# Altium schematic sheet TopSchematic.SchDoc: Title
size A4; SchTemplateVer: V2.0; Author: Adam Mizerkiewicz; CompanyName: Adam Mizerkiewicz; DrawnBy: Adam Mizerkiewicz; Engineer: Adam Mizerkiewicz; Organization: Adam Mizerkiewicz; Address1: Sarnia 2/19; Address2: 61-058 Poznań; Revision: 0.0; SheetNumber: 2; SheetTotal: 18
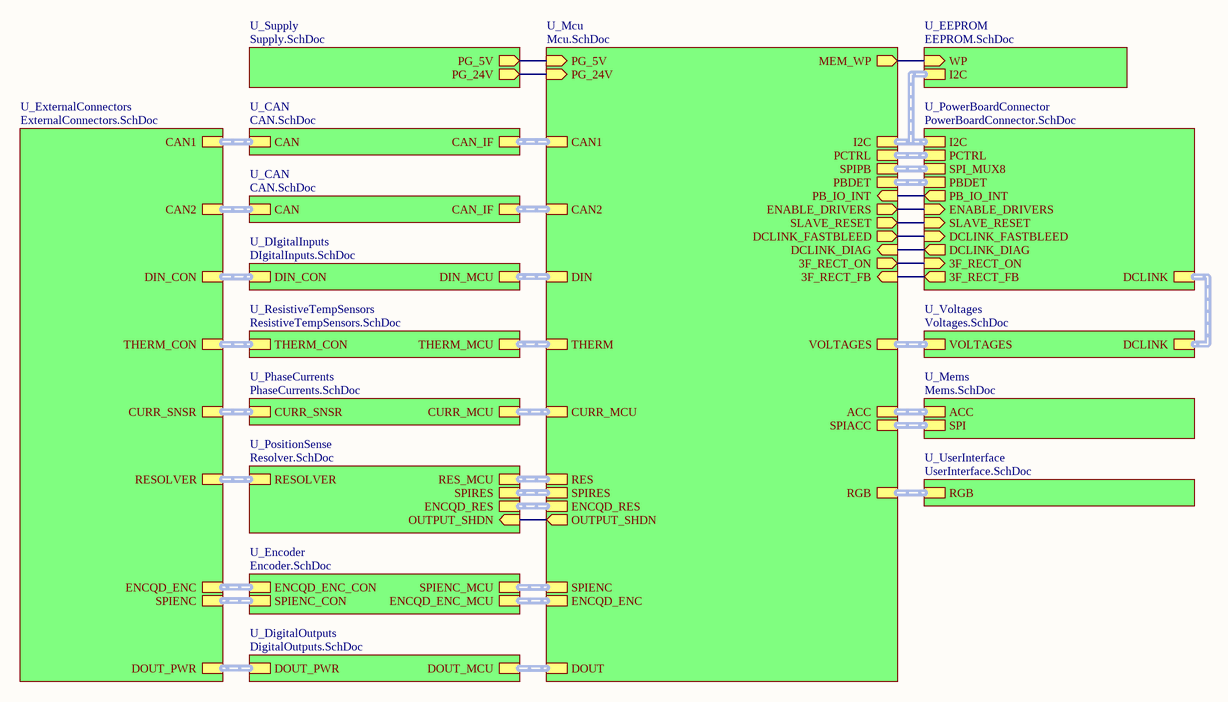
[diagram p0: TopSchematic.SchDoc]

## Sub-sheets
U_CAN = CAN.SchDoc: CAN_IF (harness CAN_IF), CAN (harness CAN)
U_CAN = CAN.SchDoc: CAN_IF (harness CAN_IF), CAN (harness CAN)
U_DIgitalInputs = DIgitalInputs.SchDoc: DIN_CON (harness DIN_CON), DIN_MCU (harness DIN_MCU)
U_DigitalOutputs = DigitalOutputs.SchDoc: DOUT_MCU (harness DOUT_MCU), DOUT_PWR (harness DOUT_PWR)
U_EEPROM = EEPROM.SchDoc: I2C (harness I2C), WP (in)
U_Encoder = Encoder.SchDoc: SPIENC_MCU (harness SPI), ENCQD_ENC_MCU (harness ENCQD), SPIENC_CON (harness SPI), ENCQD_ENC_CON (harness ENCQD)
U_ExternalConnectors = ExternalConnectors.SchDoc: CAN2 (harness CAN), DOUT_PWR (harness DOUT_PWR), DIN_CON (harness DIN_CON), THERM_CON (harness THERM_CON), RESOLVER (harness RESOLVER), SPIENC (harness SPI), CURR_SNSR (harness CURR_SNSR), CAN1 (harness CAN), ENCQD_ENC (harness ENCQD)
U_Mcu = Mcu.SchDoc: CAN1 (harness CAN_IF), CAN2 (harness CAN_IF), PCTRL (harness PCTRL), SPIPB (harness SPI_MUX8), SPIACC (harness SPI), SPIRES (harness SPI), ACC (harness ACC/GYRO), DIN (harness DIN_MCU), I2C (harness I2C), THERM (harness THERM_MCU), PBDET (harness PBDET), DOUT (harness DOUT_MCU), ENCQD_RES (harness ENCQD), SPIENC (harness SPI), RES (harness RESOLVER_IF), DCLINK_FASTBLEED (out), DCLINK_DIAG (in), PB_IO_INT (in), ENABLE_DRIVERS (out), SLAVE_RESET (out), 3F_RECT_ON (out), 3F_RECT_FB (in), VOLTAGES (harness VOLTAGES_MCU), RGB (harness RGB), ENCQD_ENC (harness ENCQD), CURR_MCU (harness CURR_MCU), OUTPUT_SHDN (out), PG_5V (in), PG_24V (in), MEM_WP (out)
U_Mems = Mems.SchDoc: ACC (harness ACC/GYRO_IF), SPI (harness SPI)
U_PhaseCurrents = PhaseCurrents.SchDoc: CURR_SNSR (harness CURR_SNSR), CURR_MCU (harness CURR_MCU)
U_PositionSense = Resolver.SchDoc: RES_MCU (harness RESOLVER_IF), SPIRES (harness SPI), ENCQD_RES (harness ENCQD), RESOLVER (harness RESOLVER), OUTPUT_SHDN (in)
U_PowerBoardConnector = PowerBoardConnector.SchDoc: SPI_MUX8 (harness SPI_MUX8), PCTRL (harness PCTRL), DCLINK_FASTBLEED (in), DCLINK_DIAG (out), PB_IO_INT (out), DCLINK (harness DC_LINK), ENABLE_DRIVERS (in), SLAVE_RESET (in), 3F_RECT_ON (in), 3F_RECT_FB (out), I2C (harness I2C), PBDET (harness PBDET)
U_ResistiveTempSensors = ResistiveTempSensors.SchDoc: THERM_MCU (harness THERM_MCU), THERM_CON (harness THERM_CON)
U_Supply = Supply.SchDoc: PG_5V (out), PG_24V (out)
U_UserInterface = UserInterface.SchDoc: RGB (harness RGB)
U_Voltages = Voltages.SchDoc: DCLINK (harness DCLINK), VOLTAGES (harness VOLTAGES_MCU)

## Nets
(unnamed): sheet U_Mcu/DCLINK_FASTBLEED, sheet U_PowerBoardConnector/DCLINK_FASTBLEED
(unnamed): sheet U_Mcu/DCLINK_DIAG, sheet U_PowerBoardConnector/DCLINK_DIAG
(unnamed): sheet U_Mcu/PB_IO_INT, sheet U_PowerBoardConnector/PB_IO_INT
(unnamed): sheet U_Mcu/ENABLE_DRIVERS, sheet U_PowerBoardConnector/ENABLE_DRIVERS
(unnamed): sheet U_Mcu/SLAVE_RESET, sheet U_PowerBoardConnector/SLAVE_RESET
(unnamed): sheet U_Mcu/3F_RECT_ON, sheet U_PowerBoardConnector/3F_RECT_ON
(unnamed): sheet U_Mcu/3F_RECT_FB, sheet U_PowerBoardConnector/3F_RECT_FB
(unnamed): sheet U_Mcu/OUTPUT_SHDN, sheet U_PositionSense/OUTPUT_SHDN
(unnamed): sheet U_Mcu/PG_5V, sheet U_Supply/PG_5V
(unnamed): sheet U_Mcu/PG_24V, sheet U_Supply/PG_24V
(unnamed): sheet U_Mcu/MEM_WP, sheet U_EEPROM/WP

## Buses and harness runs
harness sheet U_CAN/CAN = sheet U_ExternalConnectors/CAN1
harness sheet U_CAN/CAN = sheet U_ExternalConnectors/CAN2
harness sheet U_CAN/CAN_IF = sheet U_Mcu/CAN1
harness sheet U_CAN/CAN_IF = sheet U_Mcu/CAN2
harness sheet U_DIgitalInputs/DIN_CON = sheet U_ExternalConnectors/DIN_CON
harness sheet U_DIgitalInputs/DIN_MCU = sheet U_Mcu/DIN
harness sheet U_DigitalOutputs/DOUT_MCU = sheet U_Mcu/DOUT
harness sheet U_DigitalOutputs/DOUT_PWR = sheet U_ExternalConnectors/DOUT_PWR
harness sheet U_EEPROM/I2C = sheet U_Mcu/I2C = sheet U_PowerBoardConnector/I2C
harness sheet U_Encoder/ENCQD_ENC_CON = sheet U_ExternalConnectors/ENCQD_ENC
harness sheet U_Encoder/ENCQD_ENC_MCU = sheet U_Mcu/ENCQD_ENC
harness sheet U_Encoder/SPIENC_CON = sheet U_ExternalConnectors/SPIENC
harness sheet U_Encoder/SPIENC_MCU = sheet U_Mcu/SPIENC
harness sheet U_ExternalConnectors/CURR_SNSR = sheet U_PhaseCurrents/CURR_SNSR
harness sheet U_ExternalConnectors/RESOLVER = sheet U_PositionSense/RESOLVER
harness sheet U_ExternalConnectors/THERM_CON = sheet U_ResistiveTempSensors/THERM_CON
harness sheet U_Mcu/ACC = sheet U_Mems/ACC
harness sheet U_Mcu/CURR_MCU = sheet U_PhaseCurrents/CURR_MCU
harness sheet U_Mcu/ENCQD_RES = sheet U_PositionSense/ENCQD_RES
harness sheet U_Mcu/PBDET = sheet U_PowerBoardConnector/PBDET
harness sheet U_Mcu/PCTRL = sheet U_PowerBoardConnector/PCTRL
harness sheet U_Mcu/RES = sheet U_PositionSense/RES_MCU
harness sheet U_Mcu/RGB = sheet U_UserInterface/RGB
harness sheet U_Mcu/SPIACC = sheet U_Mems/SPI
harness sheet U_Mcu/SPIPB = sheet U_PowerBoardConnector/SPI_MUX8
harness sheet U_Mcu/SPIRES = sheet U_PositionSense/SPIRES
harness sheet U_Mcu/THERM = sheet U_ResistiveTempSensors/THERM_MCU
harness sheet U_Mcu/VOLTAGES = sheet U_Voltages/VOLTAGES
harness sheet U_PowerBoardConnector/DCLINK = sheet U_Voltages/DCLINK

## Notes on the sheet
- Revision
  =Revision
- Sheet
  =SheetNumber / =SheetTotal